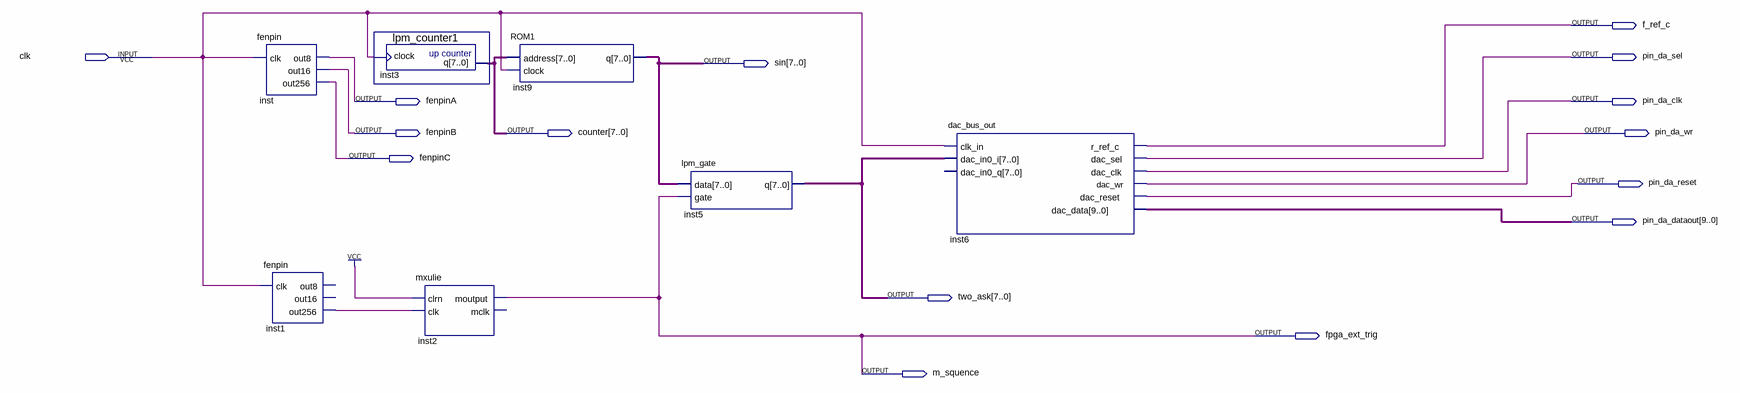
[diagram p0: schematic sheet]
// Quartus schematic twoask.bdf as structural Verilog: 7 symbols, 15 pins
module twoask (
  input  clk,
  output f_ref_c,
  output pin_da_sel,
  output [7:0] sin,
  output fenpinA,
  output pin_da_clk,
  output fenpinB,
  output [7:0] counter,
  output pin_da_wr,
  output fenpinC,
  output pin_da_reset,
  output [9:0] pin_da_dataout,
  output [7:0] two_ask,
  output fpga_ext_trig,
  output m_squence
);

  wire inst1_out256;

  fenpin inst (.clk(clk), .out8(fenpinA), .out16(fenpinB), .out256(fenpinC));
  fenpin inst1 (.clk(clk), .out256(inst1_out256));  // open: out8, out16
  lpm_counter1 inst3 (.clock(clk), .q(counter));
  mxulie inst2 (.clrn(1'b1), .clk(inst1_out256), .moutput(fpga_ext_trig));  // open: mclk
  ROM1 inst9 (.address(counter), .clock(clk), .q(sin));
  lpm_gate inst5 (.data(sin), .gate(fpga_ext_trig), .q(two_ask));
  dac_bus_out inst6 (
    .clk_in(clk), .dac_in0_i(two_ask), .r_ref_c(f_ref_c), .dac_sel(pin_da_sel), .dac_clk(pin_da_clk),
    .dac_wr(pin_da_wr), .dac_reset(pin_da_reset), .dac_data(pin_da_dataout));  // open: dac_in0_q

  assign m_squence = fpga_ext_trig;
endmodule
